# Altium schematic sheet Sheet1.SchDoc
size A4; SheetNumber: 1; SheetTotal: 1
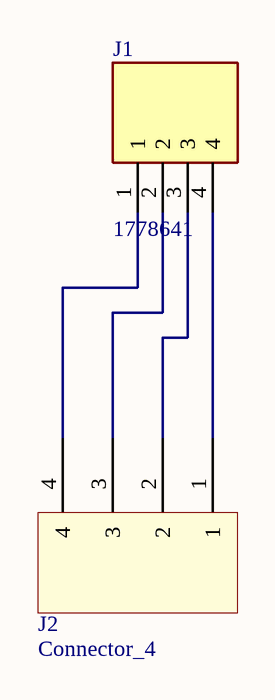
[diagram p0: Sheet1.SchDoc]

## Parts
J1  1778641  [SHDRRA4W60P0X250_1X4_1170X750X510P]
J2  Connector_4  [PTSM 0,5/ 4-2,5-H THR WH R32]

## Nets
NetJ1_1: J1.1 J2.4
NetJ1_2: J1.2 J2.3
NetJ1_3: J1.3 J2.2
NetJ1_4: J1.4 J2.1

## Library data of the parts
J1 = 1778641: PCB header, nominal cross section: 0.5 mm?, color: black, nominal current: 6 A, rated voltage (III/2): 160 V, contact surface: Tin, type of contact: Male connector, Number of potentials: 4, Number of rows: 1, Number of positions per row: 4, number of connections: 4, product range: PTSM 0,5/..-HH-THR, pitch: 2.5 mm, mounting: THR soldering, pin layout: Linear pinning, solder pin [P]: 2.1 mm, Stecksystem: COMBICON COMPACT PTSM, Locking: without, type of packaging: 32 mm wide tape; Manufacturer_Name: Phoenix Contact; Geometry.Height: 5.1mm; Manufacturer_Part_Number: 1778641; Mouser Part Number: 651-1778641; Mouser Price/Stock: https://www.mouser.co.uk/ProductDetail/Phoenix-Contact/1778641?qs=i0qWf6NAoDs%252BwkQoFV1ycQ%3D%3D; Arrow Part Number: 1778641; Arrow Price/Stock: https://www.arrow.com/en/products/1778641/phoenix-contact?region=nac; Datasheet Link: http://www.phoenixcontact.com/de/produkte/1778641/pdf